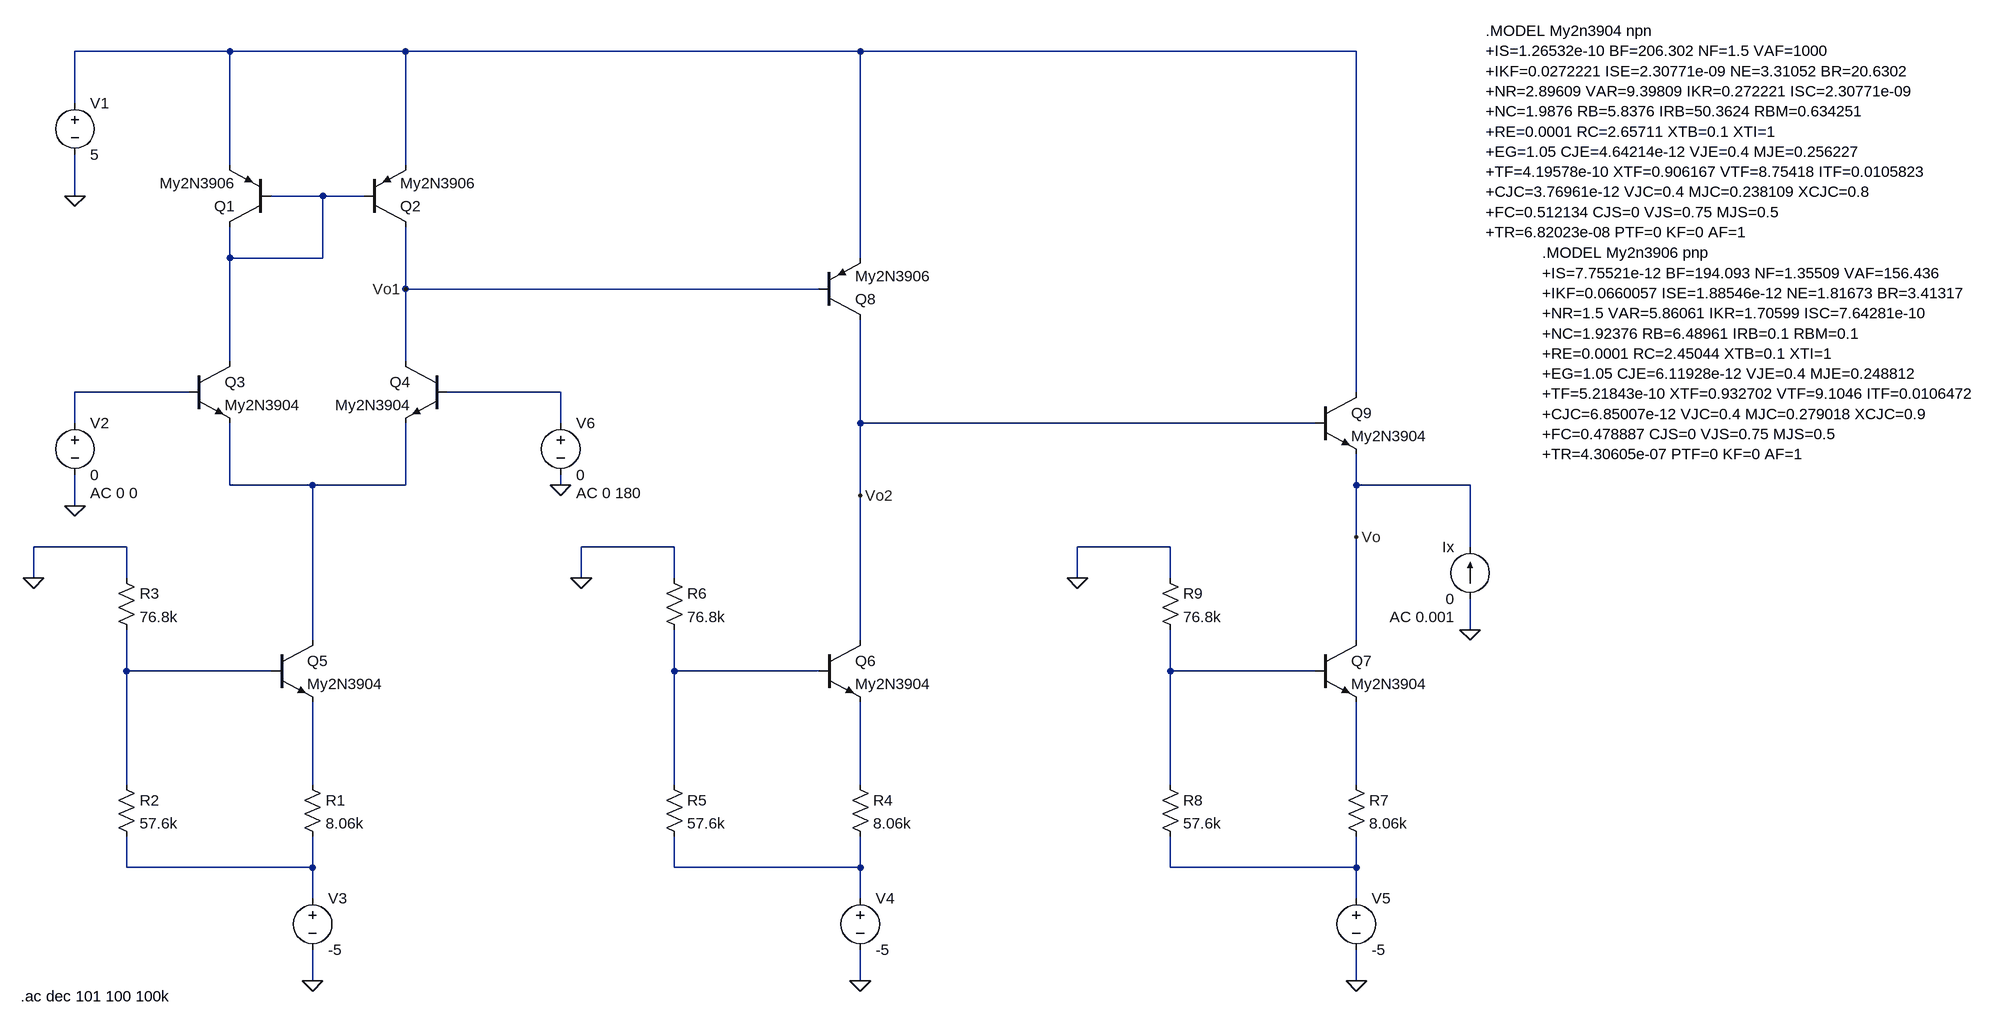
[diagram p0: schematic A.asc]
A.asc, the LTspice schematic file:
Version 4
SHEET 1 3064 1432
WIRE 304 -48 64 -48
WIRE 576 -48 304 -48
WIRE 1280 -48 576 -48
WIRE 2048 -48 1280 -48
WIRE 64 32 64 -48
WIRE 304 128 304 -48
WIRE 576 128 576 -48
WIRE 64 176 64 112
WIRE 448 176 368 176
WIRE 512 176 448 176
WIRE 304 272 304 224
WIRE 448 272 448 176
WIRE 448 272 304 272
WIRE 1280 272 1280 -48
WIRE 576 320 576 224
WIRE 1216 320 576 320
WIRE 304 432 304 272
WIRE 576 432 576 320
WIRE 240 480 64 480
WIRE 816 480 640 480
WIRE 2048 480 2048 -48
WIRE 64 528 64 480
WIRE 816 528 816 480
WIRE 1280 528 1280 368
WIRE 1984 528 1280 528
WIRE 304 624 304 528
WIRE 432 624 304 624
WIRE 576 624 576 528
WIRE 576 624 432 624
WIRE 816 624 816 608
WIRE 2048 624 2048 576
WIRE 2224 624 2048 624
WIRE 1280 640 1280 528
WIRE 64 656 64 608
WIRE 2048 704 2048 624
WIRE 144 720 0 720
WIRE 992 720 848 720
WIRE 1760 720 1616 720
WIRE 2224 720 2224 624
WIRE 0 768 0 720
WIRE 144 768 144 720
WIRE 848 768 848 720
WIRE 992 768 992 720
WIRE 1616 768 1616 720
WIRE 1760 768 1760 720
WIRE 2224 848 2224 800
WIRE 432 864 432 624
WIRE 1280 864 1280 640
WIRE 2048 864 2048 704
WIRE 144 912 144 848
WIRE 368 912 144 912
WIRE 992 912 992 848
WIRE 1216 912 992 912
WIRE 1760 912 1760 848
WIRE 1984 912 1760 912
WIRE 144 1088 144 912
WIRE 432 1088 432 960
WIRE 992 1088 992 912
WIRE 1280 1088 1280 960
WIRE 1760 1088 1760 912
WIRE 2048 1088 2048 960
WIRE 144 1216 144 1168
WIRE 432 1216 432 1168
WIRE 432 1216 144 1216
WIRE 992 1216 992 1168
WIRE 1280 1216 1280 1168
WIRE 1280 1216 992 1216
WIRE 1760 1216 1760 1168
WIRE 2048 1216 2048 1168
WIRE 2048 1216 1760 1216
WIRE 432 1264 432 1216
WIRE 1280 1264 1280 1216
WIRE 2048 1264 2048 1216
WIRE 432 1392 432 1344
WIRE 1280 1392 1280 1344
WIRE 2048 1392 2048 1344
FLAG 64 176 0
FLAG 64 656 0
FLAG 0 768 0
FLAG 432 1392 0
FLAG 848 768 0
FLAG 1280 1392 0
FLAG 1616 768 0
FLAG 2048 1392 0
FLAG 816 624 0
FLAG 2224 848 0
FLAG 576 320 Vo1
FLAG 1280 640 Vo2
FLAG 2048 704 Vo
SYMBOL voltage 64 16 R0
WINDOW 123 0 0 Left 0
WINDOW 39 0 0 Left 0
SYMATTR InstName V1
SYMATTR Value 5
SYMBOL pnp 368 224 R180
SYMATTR InstName Q1
SYMATTR Value My2N3906
SYMBOL pnp 512 224 M180
SYMATTR InstName Q2
SYMATTR Value My2N3906
SYMBOL npn 240 432 R0
SYMATTR InstName Q3
SYMATTR Value My2N3904
SYMBOL npn 640 432 M0
SYMATTR InstName Q4
SYMATTR Value My2N3904
SYMBOL voltage 64 512 R0
WINDOW 123 24 124 Left 2
WINDOW 39 0 0 Left 0
SYMATTR InstName V2
SYMATTR Value 0
SYMATTR Value2 AC 0 0
SYMBOL npn 368 864 R0
SYMATTR InstName Q5
SYMATTR Value My2N3904
SYMBOL res 416 1072 R0
SYMATTR InstName R1
SYMATTR Value 8.06k
SYMBOL res 128 1072 R0
SYMATTR InstName R2
SYMATTR Value 57.6k
SYMBOL res 128 752 R0
SYMATTR InstName R3
SYMATTR Value 76.8k
SYMBOL voltage 432 1248 R0
WINDOW 123 0 0 Left 0
WINDOW 39 0 0 Left 0
SYMATTR InstName V3
SYMATTR Value -5
SYMBOL npn 1216 864 R0
SYMATTR InstName Q6
SYMATTR Value My2N3904
SYMBOL res 1264 1072 R0
SYMATTR InstName R4
SYMATTR Value 8.06k
SYMBOL res 976 1072 R0
SYMATTR InstName R5
SYMATTR Value 57.6k
SYMBOL res 976 752 R0
SYMATTR InstName R6
SYMATTR Value 76.8k
SYMBOL voltage 1280 1248 R0
WINDOW 123 0 0 Left 0
WINDOW 39 0 0 Left 0
SYMATTR InstName V4
SYMATTR Value -5
SYMBOL npn 1984 864 R0
SYMATTR InstName Q7
SYMATTR Value My2N3904
SYMBOL res 2032 1072 R0
SYMATTR InstName R7
SYMATTR Value 8.06k
SYMBOL res 1744 1072 R0
SYMATTR InstName R8
SYMATTR Value 57.6k
SYMBOL res 1744 752 R0
SYMATTR InstName R9
SYMATTR Value 76.8k
SYMBOL voltage 2048 1248 R0
WINDOW 123 0 0 Left 0
WINDOW 39 0 0 Left 0
SYMATTR InstName V5
SYMATTR Value -5
SYMBOL voltage 816 512 R0
WINDOW 123 24 124 Left 2
WINDOW 39 0 0 Left 0
SYMATTR InstName V6
SYMATTR Value 0
SYMATTR Value2 AC 0 180
SYMBOL pnp 1216 368 M180
SYMATTR InstName Q8
SYMATTR Value My2N3906
SYMBOL npn 1984 480 R0
SYMATTR InstName Q9
SYMATTR Value My2N3904
SYMBOL current 2224 800 R180
WINDOW 0 24 80 Left 2
WINDOW 3 24 0 Left 2
WINDOW 123 24 -28 Left 2
WINDOW 39 0 0 Left 0
SYMATTR InstName Ix
SYMATTR Value 0
SYMATTR Value2 AC 0.001
TEXT 2248 -80 Left 2 !.MODEL My2n3904 npn\n+IS=1.26532e-10 BF=206.302 NF=1.5 VAF=1000\n+IKF=0.0272221 ISE=2.30771e-09 NE=3.31052 BR=20.6302\n+NR=2.89609 VAR=9.39809 IKR=0.272221 ISC=2.30771e-09\n+NC=1.9876 RB=5.8376 IRB=50.3624 RBM=0.634251\n+RE=0.0001 RC=2.65711 XTB=0.1 XTI=1\n+EG=1.05 CJE=4.64214e-12 VJE=0.4 MJE=0.256227\n+TF=4.19578e-10 XTF=0.906167 VTF=8.75418 ITF=0.0105823\n+CJC=3.76961e-12 VJC=0.4 MJC=0.238109 XCJC=0.8\n+FC=0.512134 CJS=0 VJS=0.75 MJS=0.5\n+TR=6.82023e-08 PTF=0 KF=0 AF=1
TEXT 2336 264 Left 2 !.MODEL My2n3906 pnp\n+IS=7.75521e-12 BF=194.093 NF=1.35509 VAF=156.436\n+IKF=0.0660057 ISE=1.88546e-12 NE=1.81673 BR=3.41317\n+NR=1.5 VAR=5.86061 IKR=1.70599 ISC=7.64281e-10\n+NC=1.92376 RB=6.48961 IRB=0.1 RBM=0.1\n+RE=0.0001 RC=2.45044 XTB=0.1 XTI=1\n+EG=1.05 CJE=6.11928e-12 VJE=0.4 MJE=0.248812\n+TF=5.21843e-10 XTF=0.932702 VTF=9.1046 ITF=0.0106472\n+CJC=6.85007e-12 VJC=0.4 MJC=0.279018 XCJC=0.9\n+FC=0.478887 CJS=0 VJS=0.75 MJS=0.5\n+TR=4.30605e-07 PTF=0 KF=0 AF=1
TEXT -20 1416 Left 2 !.ac dec 101 100 100k

The netlist it stands for:
* A.asc
V1 N001 0 5
Q1 N002 N002 N001 0 My2N3906
Q2 Vo1 N002 N001 0 My2N3906
Q3 N002 N003 N005 0 My2N3904
Q4 Vo1 N004 N005 0 My2N3904
V2 N003 0 0 AC 0 0
Q5 N005 N006 N009 0 My2N3904
R1 N009 N012 8.06k
R2 N006 N012 57.6k
R3 0 N006 76.8k
V3 N012 0 -5
Q6 Vo2 N007 N010 0 My2N3904
R4 N010 N013 8.06k
R5 N007 N013 57.6k
R6 0 N007 76.8k
V4 N013 0 -5
Q7 Vo N008 N011 0 My2N3904
R7 N011 N014 8.06k
R8 N008 N014 57.6k
R9 0 N008 76.8k
V5 N014 0 -5
V6 N004 0 0 AC 0 180
Q8 Vo2 Vo1 N001 0 My2N3906
Q9 N001 Vo2 Vo 0 My2N3904
Ix 0 Vo 0 AC 0.001
.model NPN NPN
.model PNP PNP
.lib standard.bjt
.MODEL My2n3904 npn
+IS=1.26532e-10 BF=206.302 NF=1.5 VAF=1000
+IKF=0.0272221 ISE=2.30771e-09 NE=3.31052 BR=20.6302
+NR=2.89609 VAR=9.39809 IKR=0.272221 ISC=2.30771e-09
+NC=1.9876 RB=5.8376 IRB=50.3624 RBM=0.634251
+RE=0.0001 RC=2.65711 XTB=0.1 XTI=1
+EG=1.05 CJE=4.64214e-12 VJE=0.4 MJE=0.256227
+TF=4.19578e-10 XTF=0.906167 VTF=8.75418 ITF=0.0105823
+CJC=3.76961e-12 VJC=0.4 MJC=0.238109 XCJC=0.8
+FC=0.512134 CJS=0 VJS=0.75 MJS=0.5
+TR=6.82023e-08 PTF=0 KF=0 AF=1
.MODEL My2n3906 pnp
+IS=7.75521e-12 BF=194.093 NF=1.35509 VAF=156.436
+IKF=0.0660057 ISE=1.88546e-12 NE=1.81673 BR=3.41317
+NR=1.5 VAR=5.86061 IKR=1.70599 ISC=7.64281e-10
+NC=1.92376 RB=6.48961 IRB=0.1 RBM=0.1
+RE=0.0001 RC=2.45044 XTB=0.1 XTI=1
+EG=1.05 CJE=6.11928e-12 VJE=0.4 MJE=0.248812
+TF=5.21843e-10 XTF=0.932702 VTF=9.1046 ITF=0.0106472
+CJC=6.85007e-12 VJC=0.4 MJC=0.279018 XCJC=0.9
+FC=0.478887 CJS=0 VJS=0.75 MJS=0.5
+TR=4.30605e-07 PTF=0 KF=0 AF=1
.ac dec 101 100 100k
.backanno
.end